# EAGLE schematic play-dev (EAGLE 6.5.0)
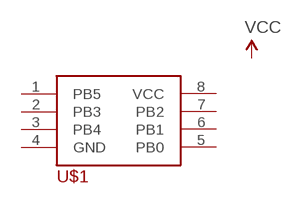
[diagram p0: schematic, sheet 1]

## Parts
U$1  ATTINY85  [DIP8]
Unconnected: U$1.1(PB5) U$1.2(PB3) U$1.3(PB4) U$1.4(GND) U$1.5(PB0) U$1.6(PB1) U$1.7(PB2) U$1.8(VCC)

## Library data of the parts
U$1 = attiny85:ATTINY85